# Altium schematic sheet 加密狗第五版.SchDoc
size A; SheetNumber: 0; SheetTotal: 0
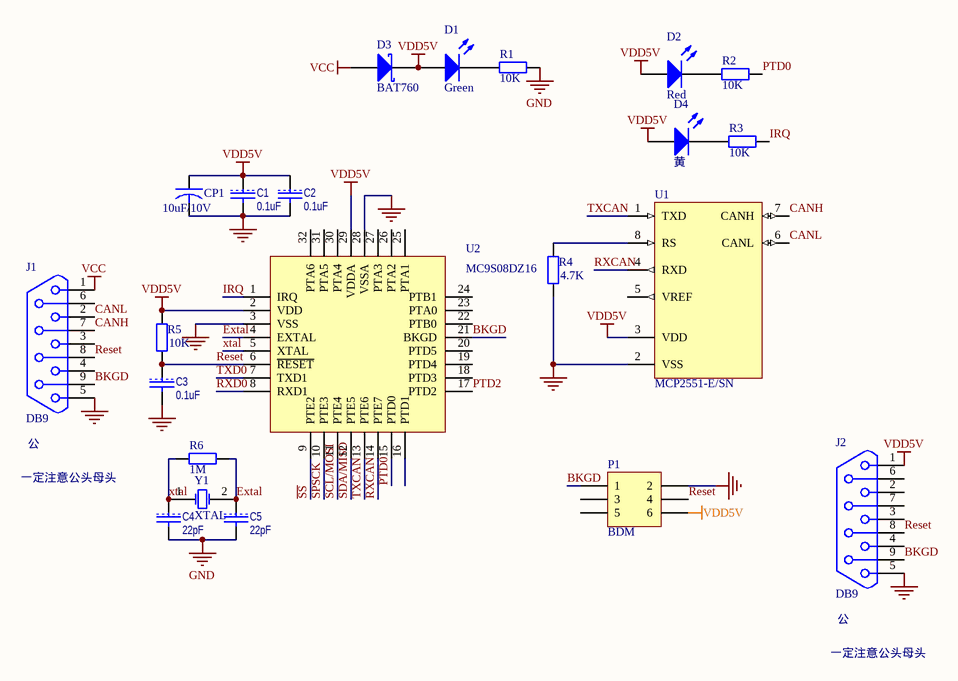
[diagram p0: 加密狗第五版.SchDoc]

## Parts
C1  0.1uF  [1608[0603]]
C2  0.1uF  [1608[0603]]
C3  0.1uF  [1608[0603]]
C4  22pF  [1608[0603]]
C5  22pF  [1608[0603]]
CP1  10uF/10V  [C1206]
D1  Green  [LED]
D2  Red  [LED]
D3  BAT760  [SOD323]
D4  黄  [LED]
J1  DB9  [DB9Male]
J2  DB9  [DB9Female]
P1  BDM  [HDR2X3]
R1  value 10K  [1608[0603] -R]  (hidden comment: Res2)
R2  value 10K  [1608[0603] -R]  (hidden comment: Res2)
R3  value 10K  [1608[0603] -R]  (hidden comment: Res2)
R4  value 4.7K  [1608[0603] -R]  (hidden comment: Res2)
R5  value 10K  [1608[0603] -R]  (hidden comment: Res2)
R6  value 1M  [1608[0603] -R]  (hidden comment: Res2)
U1  MCP2551-E/SN  [SOIC-SN8_N]
U2  MC9S08DZ16  [LQFP-32_N]
Y1  XTAL  [BCY-F2/Z13]

## Nets
GND: C1.2 C2.2 C3.2 C4.2 C5.2 CP1.2 J1.5 J2.5 P1.2 R1.1 R4.1 U1.2(VSS) U2.3(VSS) U2.28(VSSA)
VCC: D3.2(A) J1.1
VDD5V: C1.1 C2.1 CP1.1 D1.1(A) D2.1(A) D3.1(K) D4.1(A) J2.1 P1.6 R5.2 U1.3(VDD) U2.2(VDD) U2.29(VDDA)
BKGD: J1.9 J2.9 P1.1 U2.21(BKGD)
CANH: J1.7 U1.7(CANH)
CANL: J1.2 U1.6(CANL)
Extal: C5.1 R6.1 U2.4(EXTAL) Y1.2(OSC2)
IRQ: R3.1 U2.1(IRQ)
PTD0: R2.1 U2.15(PTD0)
PTD2: U2.17(PTD2)
Reset: C3.1 J1.8 J2.8 P1.4 R5.1 U2.6(~{RESET})
RXCAN: U1.4(RXD) U2.14(PTE7)
RXD0: U2.8(RXD1)
~{SS}: U2.9(PTE2)
SCL/MOSI: U2.11(PTE4)
SDA/MISO: U2.12(PTE5)
SPSCK: U2.10(PTE3)
TXCAN: U1.1(TXD) U2.13(PTE6)
TXD0: U2.7(TXD1)
xtal: C4.1 R6.2 U2.5(XTAL) Y1.1(OSC1)
NetD1_2: D1.2(K) R1.2
NetD2_2: D2.2(K) R2.2
NetD4_2: D4.2(K) R3.2
NetR4_2: R4.2 U1.8(RS)

Not connected (* = marked no-connect by the designer): J1 3 4 6; J2 2 3 4 6 7; P1 3 5; U1 5(VREF); U2 16(PTD1) 18(PTD3) 19(PTD4) 20(PTD5) 22(PTB0) 23(PTA0) 24(PTB1) 25(PTA1) 26(PTA2) 27(PTA3) 30(PTA4) 31(PTA5) 32(PTA6)

## Notes on the sheet
- (near J1) 公
- 一定注意公头母头
- (near J2) 公

## Library data of the parts
C1-C5 = CAP: Capacitor
CP1 = CAPACITOR
D1 D2 D4 = LED2: Typical RED, GREEN, YELLOW, AMBER GaAs LED; Published: 8-Jun-2000; LatestRevisionDate: 17-Jul-2002; LatestRevisionNote: Re-released for DXP Platform.; PackageVersion: Feb-2002; PackageReference: 3.2X1.6X1.1; Publisher: Altium Limited; PackageDescription: SM LED; 2 Flat Leads
D3 = BAT760: Schottky Barrier Diode; Published: 17-Sep-2003; LatestRevisionDate: 19-Mar-2004; LatestRevisionNote: Silkscreen size reduced.; DatasheetVersion: 12-Mar-2001; PackageVersion: May-1999; PackageReference: SOD323; Publisher: Altium Limited; PackageDescription: SOD-323/SC-76; 2 Leads; Body 1.7 x 1.3 mm, (LxW); ComponentLink1Description: Manufacturer Link; ComponentLink1URL: http://www.semiconductors.philips.com/; ComponentLink2Description: Datasheet; ComponentLink2URL: http://www.semiconductors.philips.com/acrobat/datasheets/BAT760_2.pdf
P1 = Header 3X2: Header, 3-Pin, Dual row; LatestRevisionDate: 17-Jul-2002; LatestRevisionNote: Re-released for DXP Platform.; Publisher: Altium Limited
R1-R6 = Res2: Resistor; Published: 8-Jun-2000; LatestRevisionDate: 17-Jul-2002; LatestRevisionNote: Re-released for DXP Platform.; PackageReference: AXIAL-0.4; Publisher: Altium Limited; PackageDescription: Axial Device, Thru-Hole; 2 Leads; 0.4 in Pin Spacing
U1 = MCP2551-E/SN: High-Speed CAN Transceiver, 8-Pin SOIC, Extended Temperature; Published: 29-Jan-2009; DatasheetVersion: revE, Jan-2007; PackageVersion: revBB, Aug-2009; PackageReference: SOIC-SN8; Publisher: Altium Limited; PackageDescription: 8-Lead Plastic Small Outline (SN) - Narrow, 3.90mm Body [SOIC]; Supplier 1: Digi-Key; Supplier Part Number 1: MCP2551-E/SN-ND; Supplier 2: Farnell; Supplier Part Number 2: 1467746; Supplier 3: Farnell; Supplier Part Number 3: 4687887; Code_JEDEC: MS-012; Code_IPC: SOIC127P600-8; ComponentLink1Description: Datasheet; ComponentLink1URL: http://ww1.microchip.com/downloads/en/DeviceDoc/21667E.pdf; ComponentLink2Description: Packaging Specification; ComponentLink2URL: http://www.microchip.com/stellent/groups/techpub_sg/documents/packagingspec/en012702.pdf; ComponentLink3Description: Microchip.com Home; ComponentLink3URL: http://www.microchip.com/
U2 = MC9S08DZ60
Y1 = XTAL: Crystal Oscillator; Published: 8-Jun-2000; LatestRevisionDate: 17-Jul-2002; LatestRevisionNote: Re-released for DXP Platform.; PackageReference: R38; Publisher: Altium Limited; PackageDescription: Crystal, Thru-Hole; 2 Leads; Body 3.1 x 8.2 mm (Dia.xH)